# EAGLE design rapidshark-half-assed-half-h-bridge-mk-1.3 (EAGLE 7.5.0)
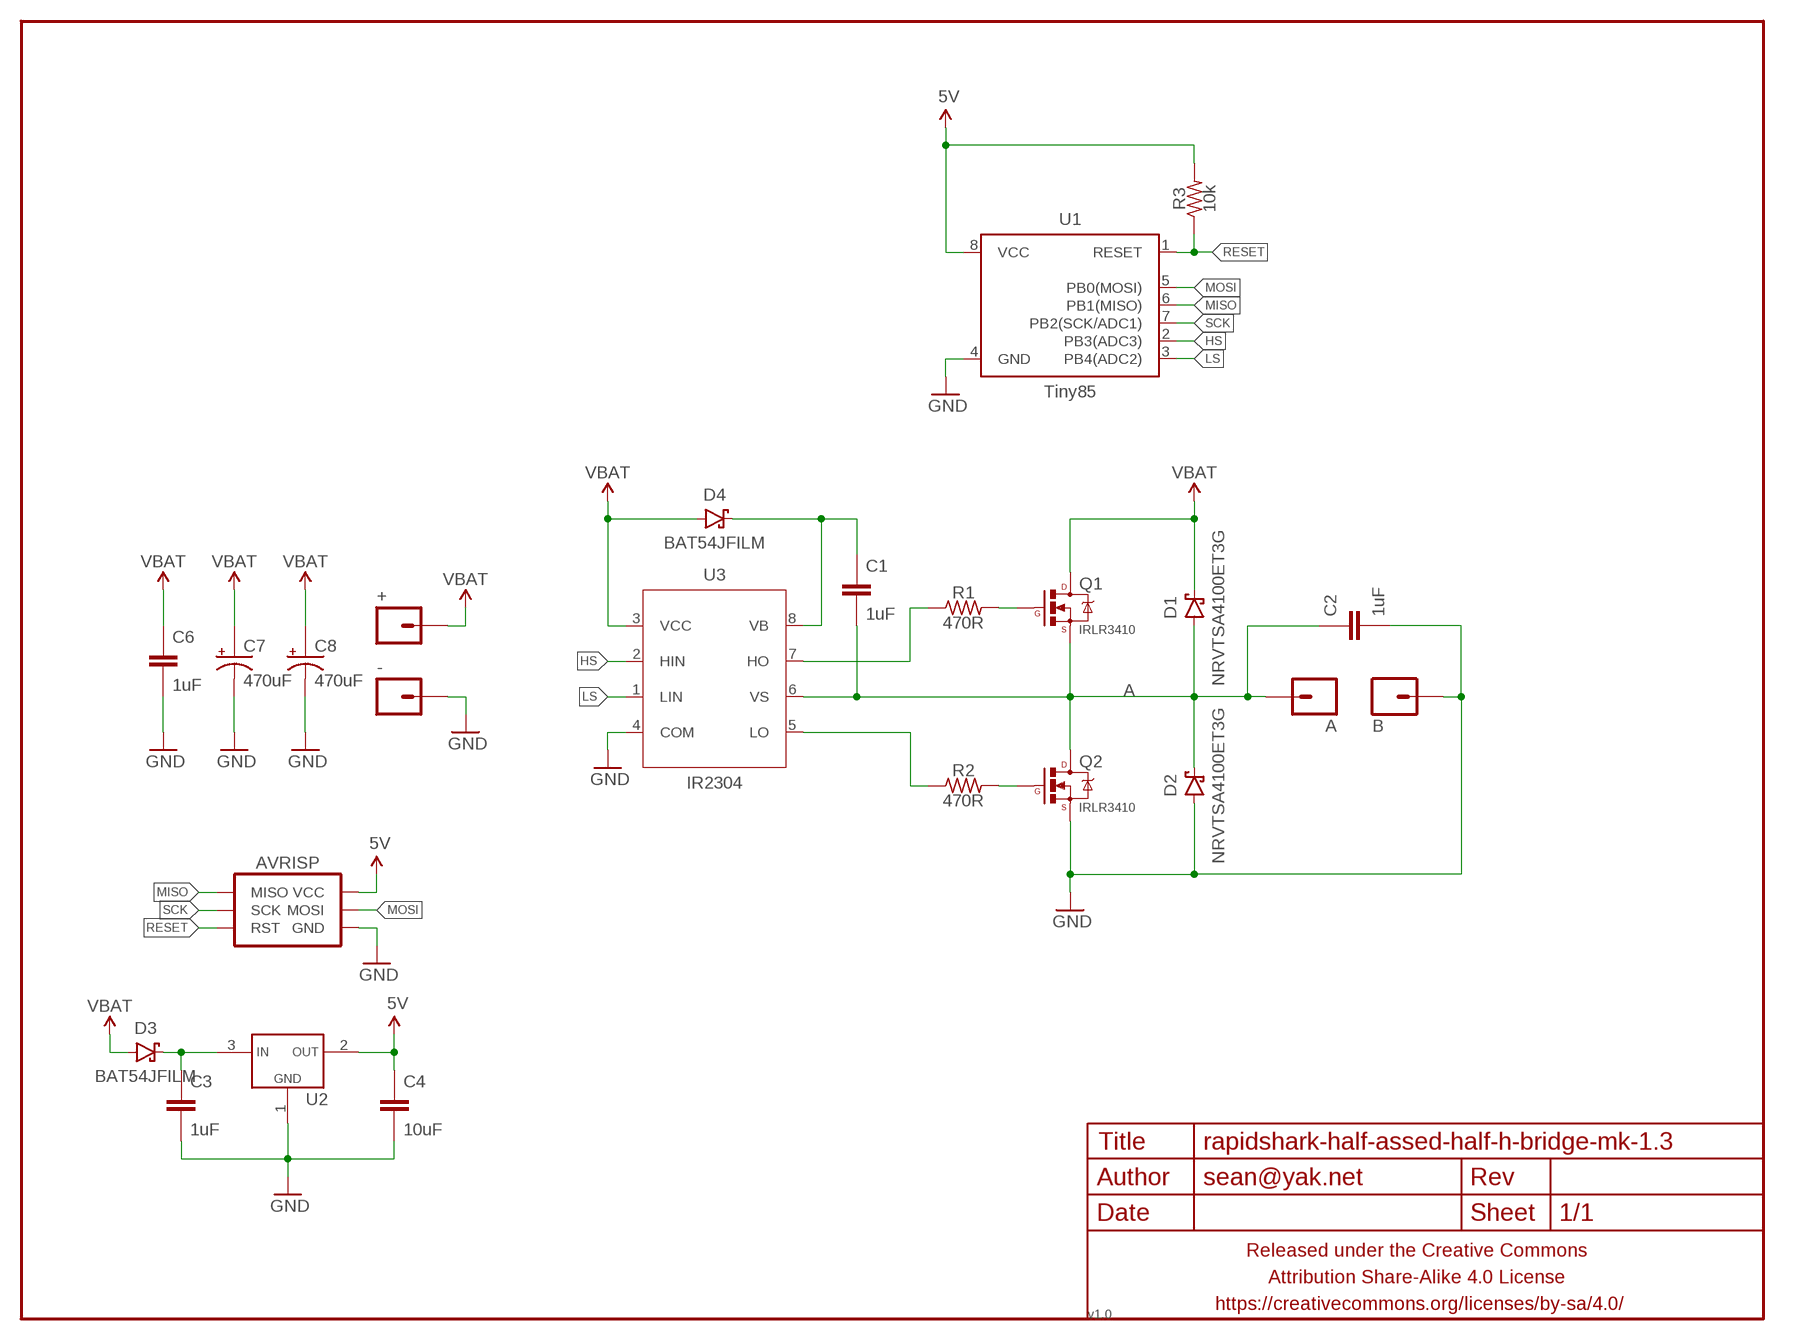
[diagram p0: schematic, sheet 1]

## Parts
+  M01PTH-1.4MM  [1X01-1.4MM-CIR]
-  M01PTH-1.4MM  [1X01-1.4MM-CIR]
A  M01PTH-1.4MM  [1X01-1.4MM-CIR]
AVRISP  AVR_SPI_PRG_6INLINE  [AVR_MINI_PROG]
B  M01PTH-1.4MM  [1X01-1.4MM-CIR]
C1  1uF  CAPACITOR-CERAMICC0603-TIGHTER  [C0603-TIGHTER]
C2  1uF  CAPACITOR-CERAMICC0603-TIGHTER  [C0603-TIGHTER]
C3  1uF  CAPACITOR-CERAMICC0603-TIGHTER  [C0603-TIGHTER]
C4  10uF  CAPACITOR-CERAMICC0805-TIGHTER  [C0805-TIGHTER]
C6  1uF  CAPACITOR-CERAMICC0603-TIGHTER  [C0603-TIGHTER]
C7  470uF  CAPACITOR-POLARIZEDE5-10.5  [E5-10,5]
C8  470uF  CAPACITOR-POLARIZEDE5-10.5  [E5-10,5]
D1  NRVTSA4100ET3G  DIODE-SCHOTTKYSMA  [SMA-DIODE-SCHOTTKY]
D2  NRVTSA4100ET3G  DIODE-SCHOTTKYSMA  [SMA-DIODE-SCHOTTKY]
D3  BAT54JFILM  DIODE-SCHOTTKYSOD323  [SOD323-SCHOTTKY]
D4  BAT54JFILM  DIODE-SCHOTTKYSOD323  [SOD323-SCHOTTKY]
FRAME1  FRAME-LETTERNO_PACKAGE  [DUMMY]
Q1  IRLR3410  MOSFET-NCHANNELFDD8780  [DPAK]
Q2  IRLR3410  MOSFET-NCHANNELFDD8780  [DPAK]
R1  470R  RESISTORR0603-TIGHTER  [R0603-TIGHTER]
R2  470R  RESISTORR0603-TIGHTER  [R0603-TIGHTER]
R3  10k  RESISTORR0603-TIGHTER  [R0603-TIGHTER]
U1  Tiny85  ATTINY45TINY85-20-SOICW  [SO08-EIAJ]
U2  VREG_1117SOT-23  [SOT23]
U3  IR2304  IR2304SSOIC  [SO08]

## Nets
5V: AVRISP.2(VCC) C4.1 R3.2 U1.8(VCC) U2.2(VOUT)
A: A.P$1 C1.2 C2.1 D1.A D2.C Q1.3(S) Q2.4(D) U3.6(VS)
GND: -.P$1 AVRISP.6(GND) B.P$1 C2.2 C3.2 C4.2 C6.2 C7.- C8.- D2.A Q2.3(S) U1.4(GND) U2.1(GND) U3.4(COM)
HS: U1.2(PB3(ADC3)) U3.2(HIN)
LS: U1.3(PB4(ADC2)) U3.1(LIN)
MISO: AVRISP.1(MISO) U1.6(PB1(MISO))
MOSI: AVRISP.4(MOSI) U1.5(PB0(MOSI))
N$1: Q1.1(G) R1.2
N$2: Q2.1(G) R2.2
N$3: R1.1 U3.7(HO)
N$4: R2.1 U3.5(LO)
N$5: C1.1 D4.C U3.8(VB)
N$6: C3.1 D3.C U2.3(VIN)
RESET: AVRISP.5(RST) R3.1 U1.1(RESET)
SCK: AVRISP.3(SCK) U1.7(PB2(SCK/ADC1))
VBAT: +.P$1 C6.1 C7.+ C8.+ D1.C D3.A D4.A Q1.4(D) U3.3(VCC)

## Library data of the parts
+ - A B = a_parts:M01: Header 1 Standard 1-pin 0.1" header. Use with straight break away headers (SKU : PRT-00116), right angle break away headers (PRT-00553), swiss pins (PRT-00743), machine pins (PRT-00117), and female headers (PRT-00115).
AVRISP = a_parts:AVR_SPI_PRG_6: AVR ISP 6 Pin This is the reduced ISP connector for AVR programming. Common on Arduino. This footprint will take up less PCB space and can be used with a 10-pin to 6-pin adapter such as SKU: BOB-08508 **Special note about "TEST_POINT" package. The stop mask is on the top side, so if you want your programming test points to be on the bottom of your board, make sure to place this package on the bottom side of the board. This also ensure that the orientation to program from the bottom side will be correct.
C1-C4 C6 = a_parts:CAPACITOR-CERAMIC: CAPACITOR, European symbol
C7 C8 = a_parts:CAPACITOR-POLARIZED: POLARIZED CAPACITOR, American symbol
D1-D4 = a_parts:DIODE-SCHOTTKY: Schottky diodes in SFE's production catalog BAT20J 1A 23V 0.62Vf RB751 120mA 40V 0.37Vf PMEG4005EJ 0.5A 40V 0.42Vf MBRA140 1A 40V 0.5Vf B340A 3A 40V SMA
FRAME1 = A_butts:FRAME-LETTER: Schematic Frame Standard 8.5x11 US Letter frame; DESIGNER: sean@yak.net; VERSION: v1.0
Q1 Q2 = a_parts:MOSFET-NCHANNEL: Common NMOSFET Parts MFG P/N Store ID Prod ID FDD8780 TRANS-09984 SI7820DN TRANS-11055 FDS6630A IC-08089 2N7002PW TRANS-11151 FQP30N06L COM-10213 TRANS-10060 BSS123LT1G TRANS-08345 BSS138 TRANS-00830 BS170 2N7000; PROD_ID: TRANS-09984
R1-R3 = a_parts:RESISTOR: RESISTOR, American symbol
U1 = a_parts:ATTINY45: Atmel 8-pin 2/4/8kB flash uC; PROD_ID: IC-09092; VALUE: Tiny85-20-SMT
U2 = a_parts:VREG_1117
U3 = a_parts:IR2304S

## Board
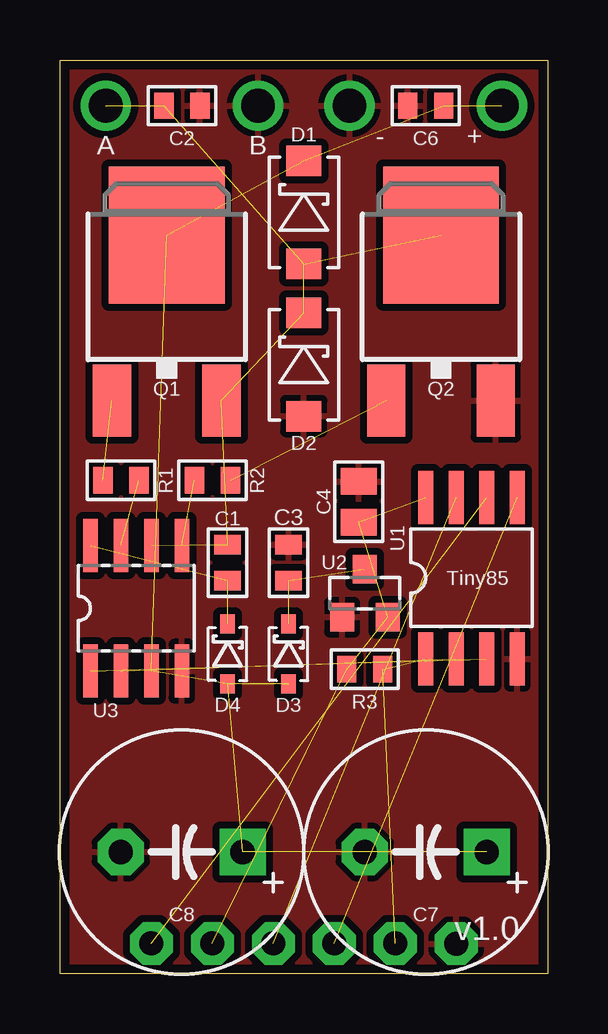
[diagram p1: board, top side]
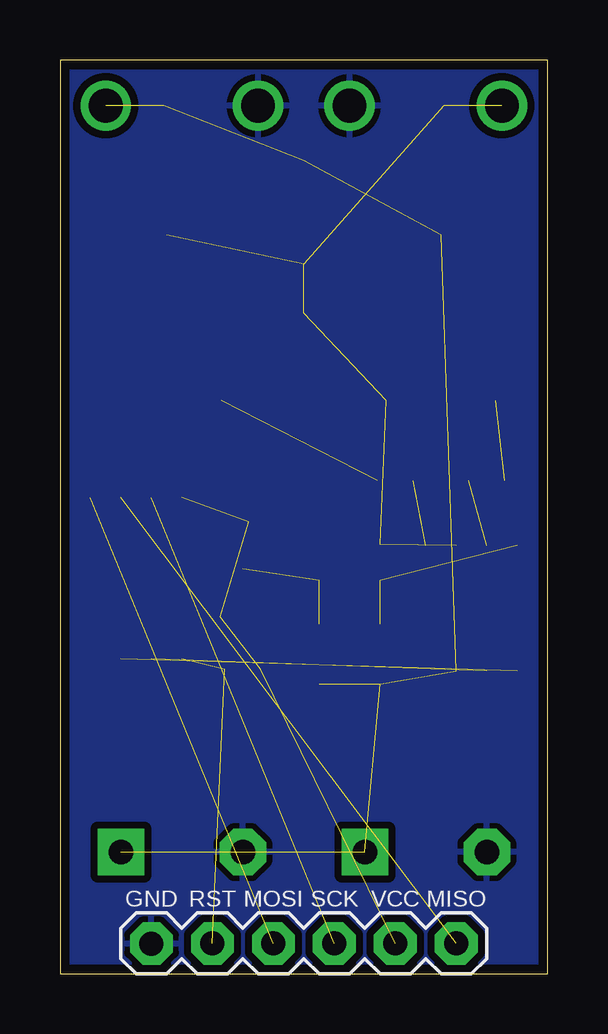
[diagram p2: board, bottom side, seen from below]

Size 20.32 x 38.1 mm. Coordinates in mm from the lower left corner, seen from the top.
Outline: 20.32,0 0,0 0,38.1 20.32,38.1 20.32,0
Copper layers (1*16): Top 0.0356mm / dielectric 1.5011mm / Bottom 0.0356mm
Design rules "LaenPCBOrder_2": minimum track width 6mil, minimum drill 13mil, track to track 6mil, track to pad 6mil, pad to pad 6mil, via to via 6mil, smd to smd 6mil, copper to edge 15mil, drill to drill 6mil, minimum pad ring 7mil, minimum via ring 7mil, stop-mask expansion 3mil, vias tented up to drill 20mil, thermal gap 10mil

### Footprints (pad centres in the part's own frame; a part is rotated, then mirrored left to right if it is on the bottom)
1X01-1.4MM-CIR = drill 1.4 pad 2.1: P$1 0,0
AVR_MINI_PROG = drill 1 pad 1.778 octagon: 1 -6.35,0; 2 -3.81,0; 3 -1.27,0; 4 1.27,0; 5 3.81,0; 6 6.35,0.01
C0603-TIGHTER = smd 0.8 x 1.1: 1 -0.75,0; 2 0.75,0
C0805-TIGHTER = smd 1.1 x 1.5: 1 -0.85,0; 2 0.85,0
E5-10,5 = drill 1.016 pad 1.93 square: + -2.54,0 | drill 1.016 pad 1.93 octagon: - 2.54,0
SMA-DIODE-SCHOTTKY = smd 1.27 x 1.47: A -2.15,0; C 2.15,0
SOD323-SCHOTTKY = smd 0.8 x 0.6: A -1.25,0; C 1.25,0
DPAK = smd 1.6 x 3: 1 -2.28,-5.31; 3 2.28,-5.31 | smd 4.826 x 5.715: 4 0,1.588
R0603-TIGHTER = smd 0.8 x 1.1: 1 -0.75,0; 2 0.75,0
SO08-EIAJ = smd 0.61 x 2.21: 1 -1.905,-3.378; 2 -0.635,-3.378; 3 0.635,-3.378; 4 1.905,-3.378; 5 1.905,3.353; 6 0.635,3.353; 7 -0.635,3.353; 8 -1.905,3.353
SOT23 = smd 1 x 1.2: 1 -0.95,-1; 2 0.95,-1; 3 0,1
SO08 = smd 0.61 x 2.21: 1 -1.905,-2.616; 2 -0.635,-2.616; 3 0.635,-2.616; 4 1.905,-2.616; 5 1.905,2.616; 6 0.635,2.616; 7 -0.635,2.616; 8 -1.905,2.616

### Placement (x,y rotation side)
+  18.41,36.2 0 top
-  12.06,36.2 0 top
A  1.91,36.2 0 top
AVRISP  10.16,1.27 180 bottom
B  8.26,36.2 0 bottom
C1  6.99,17.14 90 top
C2  5.08,36.2 0 top
C3  9.53,17.14 90 top
C4  12.45,19.68 90 top
C6  15.24,36.2 180 top
C7  15.24,5.08 180 top
C8  5.07,5.08 180 top
D1  10.16,31.75 90 top
D2  10.16,25.4 90 top
D3  9.53,13.34 90 top
D4  6.99,13.34 90 top
FRAME1  0,0 0 top
Q1  4.45,29.21 0 top
Q2  15.88,29.21 0 top
R1  2.54,20.57 180 top
R2  6.35,20.57 0 top
R3  12.7,12.7 180 top
U1  17.14,16.51 0 top
U2  12.7,15.88 0 top
U3  3.17,15.24 0 top
U$1  [COW_SMALL_METAL_NOTEXT]  36.83,22.86 0 bottom  (outside the outline)
U$2  [CC-BY-SA-4.0-NO-URL]  36.83,15.88 0 bottom  (outside the outline)
U$3  [OSHWLOGO_TINY_SILKONLY]  41.27,15.88 0 top  (outside the outline)

### Tracks (layer width: path | path; a pad name or v marks a point on that pad's centre or on a via)
5V  (4 unrouted)
A  (7 unrouted)
GND
  pour Bottom (isolate 0.305, rank 5): 20.32,38.1 20.32,0 0,0 0,38.1
  pour Top (isolate 0.305, rank 5): 20.32,38.1 20.32,0 0,0 0,38.1
HS  (1 unrouted)
LS  (1 unrouted)
MISO  (1 unrouted)
MOSI  (1 unrouted)
N$1  (1 unrouted)
N$2  (1 unrouted)
N$3  (1 unrouted)
N$4  (1 unrouted)
N$5  (2 unrouted)
N$6  (2 unrouted)
RESET  (2 unrouted)
SCK  (1 unrouted)
VBAT  (8 unrouted)

### Text on the board
bPlace: Half-Assed / Half Bridge | by schizobovine / <sean@yak.net>